# Altium schematic sheet Sheet3.SchDoc
size A; SheetNumber: 3; SheetTotal: 5
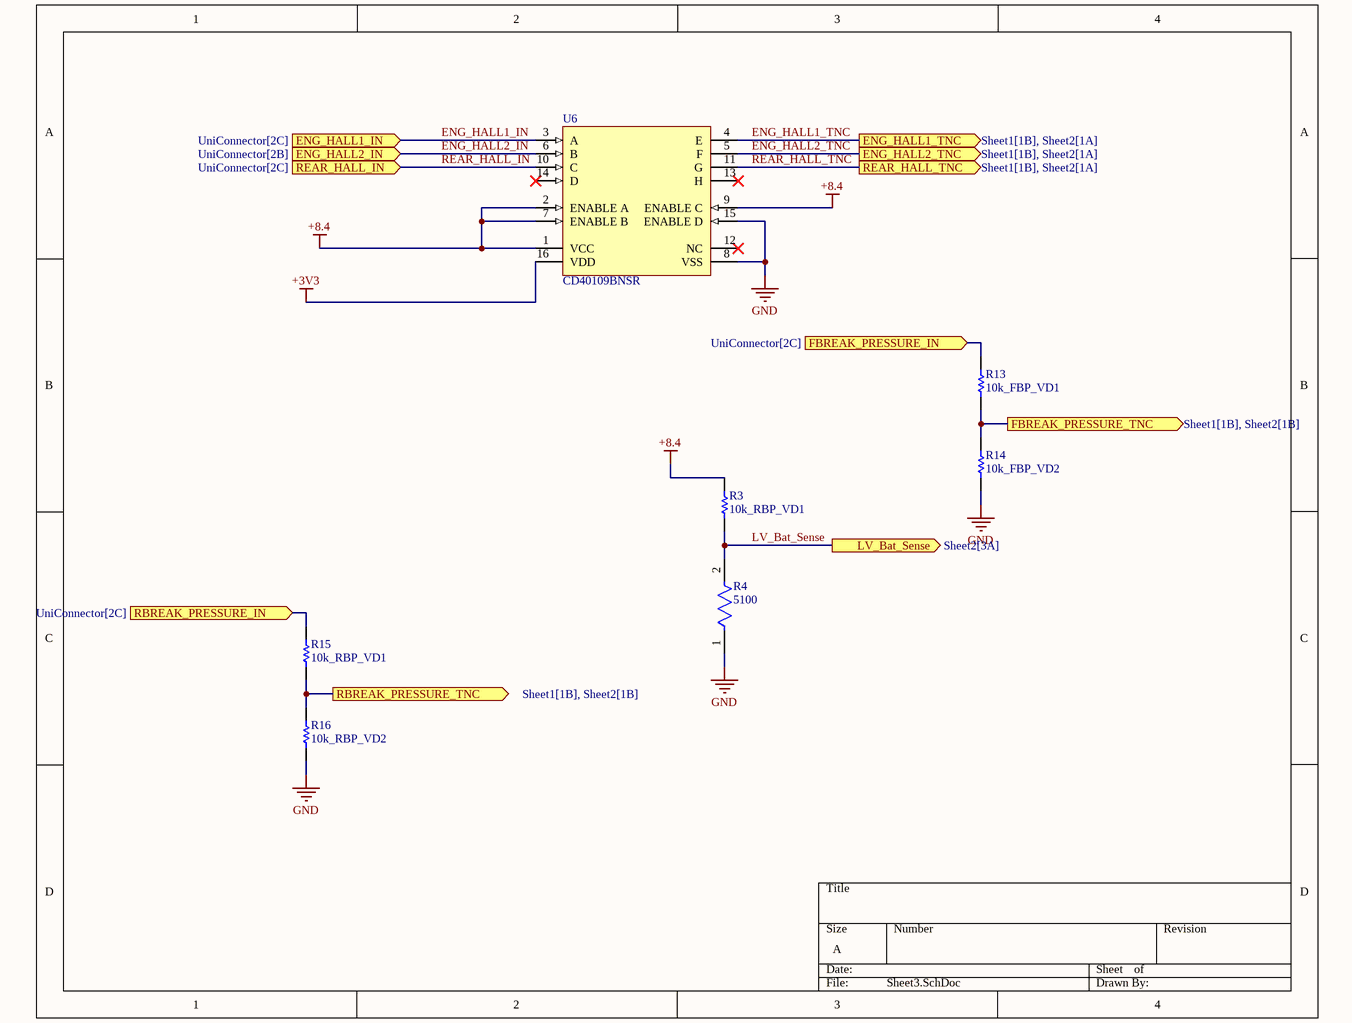
[diagram p0: Sheet3.SchDoc]

## Parts
R3  10k_RBP_VD1  [RESC2013X60X40LL20T25]
R4  5100  [FP-CRCW0805-e3-MFG]
R13  10k_FBP_VD1  [RESC2013X60X40LL20T25]
R14  10k_FBP_VD2  [RESC2013X60X40LL20T25]
R15  10k_RBP_VD1  [RESC2013X60X40LL20T25]
R16  10k_RBP_VD2  [RESC2013X60X40LL20T25]
U6  CD40109BNSR  [NS0016A_N]

## Ports
ENG_HALL1_IN (in, see UniConnector[2C]), ENG_HALL1_TNC (out, see Sheet1[1B], Sheet2[1A]), ENG_HALL2_IN (in, see UniConnector[2B]), ENG_HALL2_TNC (out, see Sheet1[1B], Sheet2[1A]), FBREAK_PRESSURE_IN (in, see UniConnector[2C]), FBREAK_PRESSURE_TNC (out, see Sheet1[1B], Sheet2[1B]), LV_Bat_Sense (out, see Sheet2[3A]), RBREAK_PRESSURE_IN (in, see UniConnector[2C]), RBREAK_PRESSURE_TNC (out, see Sheet1[1B], Sheet2[1B]), REAR_HALL_IN (in, see UniConnector[2C]), REAR_HALL_TNC (out, see Sheet1[1B], Sheet2[1A])

## Nets
+3V3: U6.16(VDD)
+8.4: R3.2 U6.1(VCC) U6.2(ENABLE_A) U6.7(ENABLE_B) U6.9(ENABLE_C)
GND: R4.1 R14.1 R16.1 U6.8(VSS) U6.15(ENABLE_D)
ENG_HALL1_IN: U6.3(A) ; port ENG_HALL1_IN
ENG_HALL1_TNC: U6.4(E) ; port ENG_HALL1_TNC
ENG_HALL2_IN: U6.6(B) ; port ENG_HALL2_IN
ENG_HALL2_TNC: U6.5(F) ; port ENG_HALL2_TNC
FBREAK_PRESSURE_IN: R13.2 ; port FBREAK_PRESSURE_IN
FBREAK_PRESSURE_TNC: R13.1 R14.2 ; port FBREAK_PRESSURE_TNC
LV_Bat_Sense: R3.1 R4.2 ; port LV_Bat_Sense
RBREAK_PRESSURE_IN: R15.2 ; port RBREAK_PRESSURE_IN
RBREAK_PRESSURE_TNC: R15.1 R16.2 ; port RBREAK_PRESSURE_TNC
REAR_HALL_IN: U6.10(C) ; port REAR_HALL_IN
REAR_HALL_TNC: U6.11(G) ; port REAR_HALL_TNC

Not connected (* = marked no-connect by the designer): U6 12(NC)* 13(H)* 14(D)*

## Library data of the parts
R3 R13-R16 = CMP-2001-00877-1: Manufacturer: Panasonic; Part Number: ERA6AEB7870V
R4 = CMP-2001-04024-2: RES Thick Film, 5.1kΩ, 1%, 0.125W, 100ppm/°C, 0805 CRCW08055K10FKEA; Power Rating: 125mW; Voltage Rating (DC): 150V; Resistance: 5.1kR; Packaging: Tape and Reel; Case Code (Metric): 2012; Contact Plating: Tin; Case Code (Imperial): 0805; Depth: 1.25mm; Tolerance: 1%; Width: 0.049inch; Temperature Coefficient: 100ppm/°C; Max Power Dissipation: 125mW; Military Standard: Not; Lead Free: Lead Free; Mount: Surface Mount; Min Operating Temperature: -55°C; Package Quantity: 10; Weight: 0.000194oz; Height: 0.45mm; Number of Terminations: 2; Max Operating Temperature: 155°C; Termination: SMD/SMT; Case/Package: 0805; Composition: Thick Film; Voltage Rating: 150V; Length: 2mm; Features: Automotive AEC-Q200; Radiation Hardening: No
U6 = CMP-1527-00005-2: CMOS Quad Low-to-High Voltage Level Shifter, 3 to 18 V, -55 to 125 degC, 16-Pin SO (NS16), RoHS, Tape and Reel; Manufacturer: Texas Instruments; Number of Channels: 4; VSS: 3 to 18 V; Propagation Delay: 240 ns Max.; ComponentLink2Description: Datasheet; PackageDescription: 16-Pin Plastic Small Outline Package, Body 10.2 x 5.3 mm, Pitch 1.27 mm; Mounting Technology: Surface Mount; Number of Outputs: 4; ComponentLink3URL: http://www.ti.com/lit/ml/msop002a/msop002a.pdf; Packing: Tape and Reel; RoHS: TRUE; Temperature Range: -55 to 125 degC; PartNumber: CD40109BNSR; PackageVersion: 4040062/C; ComponentLink3Description: Package Specification; DatasheetVersion: SCHS099B; ComponentLink2URL: http://www.ti.com/lit/ds/symlink/cd40109b.pdf; Package Reference: NS0016A; Number of Bits: 4; ComponentLink1Description: Manufacturer URL; ComponentLink1URL: www.ti.com